# Altium schematic sheet CAN_MAX3051.SchDoc
size A4
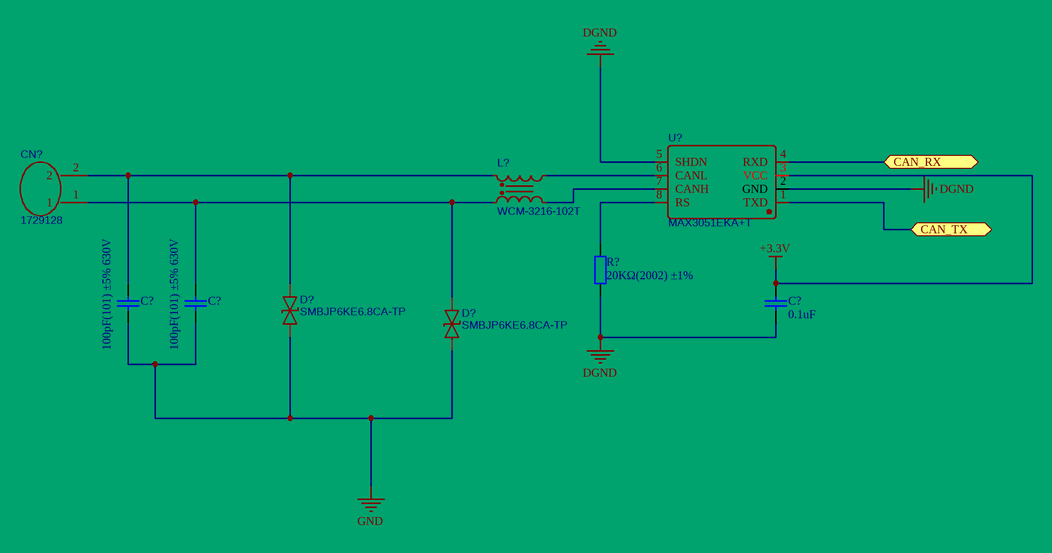
[diagram p0: CAN_MAX3051.SchDoc]

## Parts
(Parts that share a designator on the sheet are numbered #1, #2 ... from top to bottom, then left to right.)
C?#1  100pF(101) ±5% 630V  [0805_C]
C?#2  100pF(101) ±5% 630V  [0805_C]
C?#3  0.1uF  [0805_C]
CN?  1729128  [CONN-TH_2P-P5.08_1714984]
D?#1  SMBJP6KE6.8CA-TP  [SMB_L4.6-W3.6-LS5.3-BI]
D?#2  SMBJP6KE6.8CA-TP  [SMB_L4.6-W3.6-LS5.3-BI]
L?  WCM-3216-102T  [FILTER-SMD_1206-4P-L3.2-W1.6-BL-CW]
R?  20KΩ(2002) ±1%  [0805_R]
U?  MAX3051EKA+T  [SOT-23-8_L3.0-W1.7-P0.65-LS2.8-TL]

## Ports
CAN_RX, CAN_TX

## Nets
+3.3V: C?#3.2 U?.3(VCC)
DGND: C?#3.1 R?.1 U?.2(GND) U?.5(SHDN)
GND: C?#1.1 C?#2.1 D?#1.1 D?#2.1
CAN_RX: U?.4(RXD) ; port CAN_RX
CAN_TX: U?.1(TXD) ; port CAN_TX
NetC?#1_2: C?#1.2 CN?.2 D?#1.2 L?.1
NetC?#2_2: C?#2.2 CN?.1 D?#2.2 L?.2
NetL?_3: L?.3 U?.7(CANH)
NetL?_4: L?.4 U?.6(CANL)
NetR?_2: R?.2 U?.8(RS)

## Library data of the parts
C?#1 C?#2 = 0805 1uF (105) 10% 50V: 贴片电容; BOM_Manufacturer: muRata; BOM_Manufacturer Part: GRM21A5C2J101JWA1D; Package: 0805
C?#3 = 0805 1uF (105) 10% 50V: 贴片电容; Package: 0805; Supplier: muRata; SuppliersPartNumber: GCM21BR72A104KA37L
CN? = MKDSN1.5/2-5.08: BOM_Manufacturer: Phoenix Contact; BOM_Manufacturer Part: 1729128
D?#1 D?#2 = SMBJP6KE6.8CA-TP: BOM_Manufacturer: MCC(Micro Commercial Components); BOM_Manufacturer Part: SMBJP6KE6.8CA-TP; Package: SMB
L? = WCM-3216-102T: BOM_Manufacturer: Kingcore; 可更换为: CC1812C513R-10; BOM_Manufacturer Part: WCM-3216-102T
R? = 0805 1KΩ (1001) 1%: 贴片电阻; BOM_Manufacturer: ROHM; BOM_Manufacturer Part: MCR10EZPF2002; Package: 0805
U? = MAX3051EKA: BOM_Manufacturer: MAXIM; BOM_Manufacturer Part: MAX3051EKA+T